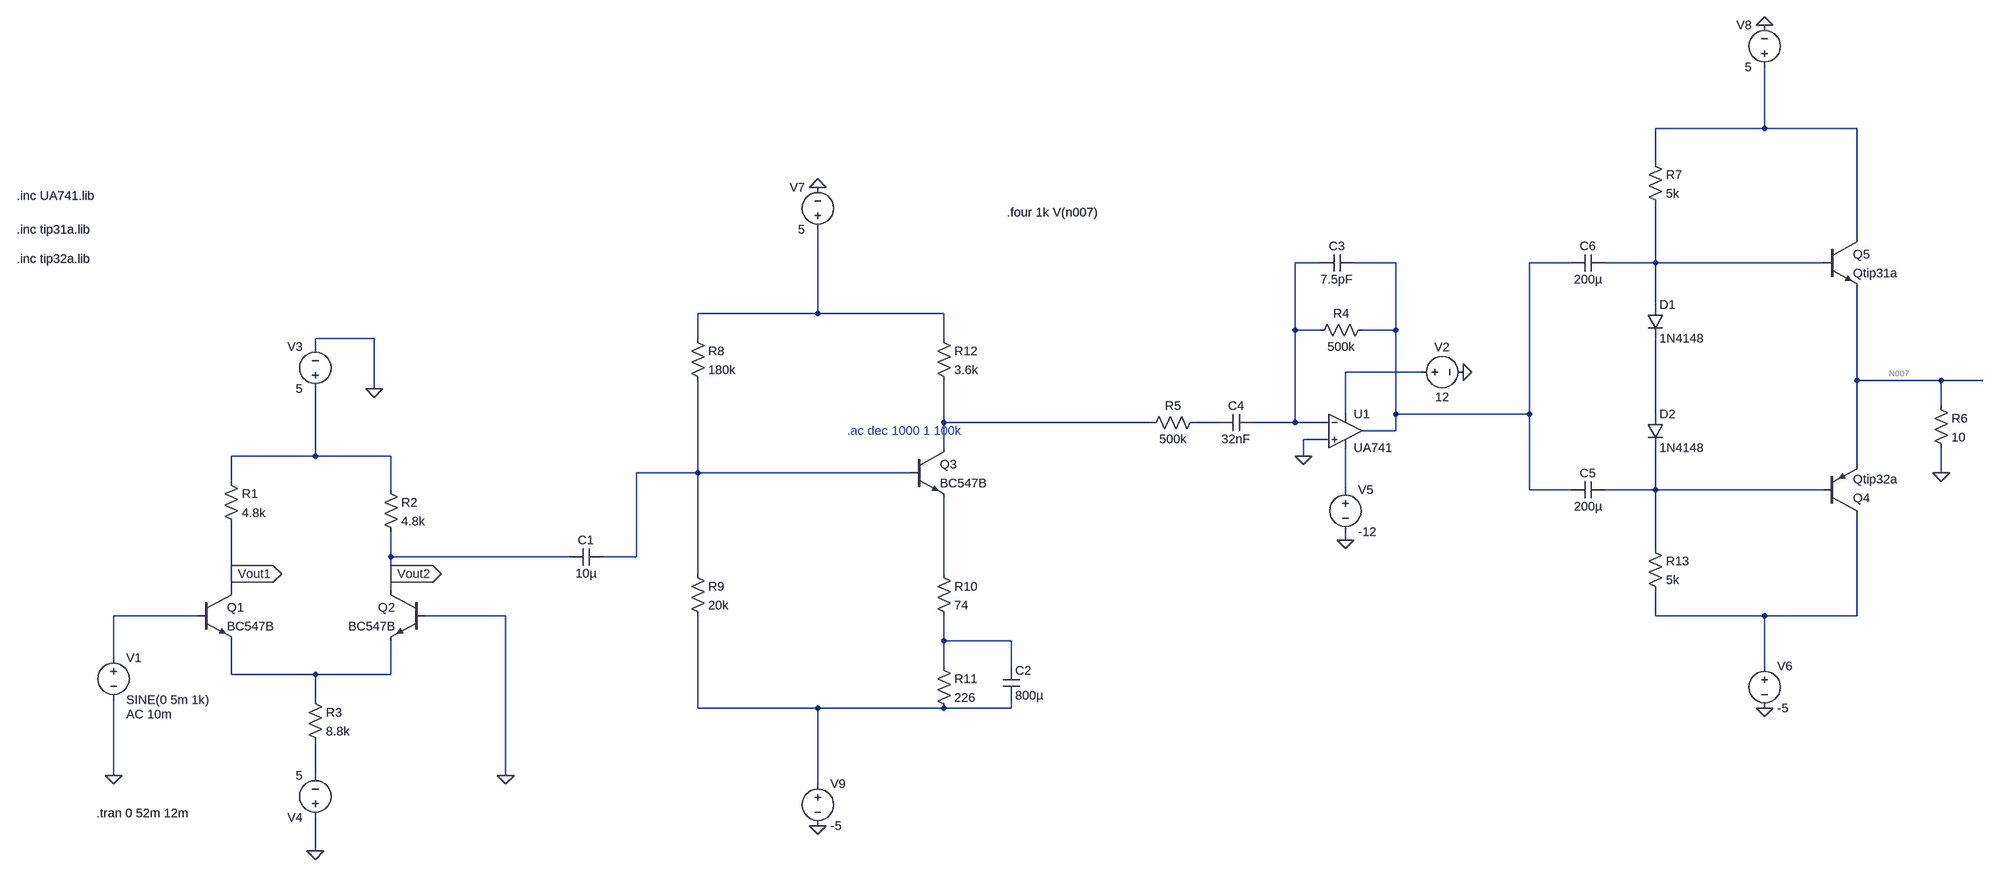
[diagram p0: schematic final_ckt.asc]
final_ckt.asc, the LTspice schematic file:
Version 4.1
SHEET 1 4872 680
WIRE 3392 -880 3392 -1040
WIRE 3392 -880 3184 -880
WIRE 3568 -880 3392 -880
WIRE 3184 -816 3184 -880
WIRE 3568 -672 3568 -880
WIRE 2528 -624 2480 -624
WIRE 2672 -624 2592 -624
WIRE 3024 -624 2944 -624
WIRE 3184 -624 3184 -736
WIRE 3184 -624 3088 -624
WIRE 3504 -624 3184 -624
WIRE 3184 -544 3184 -624
WIRE 1552 -528 1552 -688
WIRE 1552 -528 1312 -528
WIRE 1792 -528 1552 -528
WIRE 2480 -496 2480 -624
WIRE 2528 -496 2480 -496
WIRE 2672 -496 2672 -624
WIRE 2672 -496 2608 -496
WIRE 256 -480 144 -480
WIRE 1312 -480 1312 -528
WIRE 1792 -480 1792 -528
WIRE 144 -464 144 -480
WIRE 2720 -416 2576 -416
WIRE 3568 -400 3568 -576
WIRE 3728 -400 3568 -400
WIRE 3808 -400 3728 -400
WIRE 256 -384 256 -480
WIRE 3728 -352 3728 -400
WIRE 2576 -336 2576 -416
WIRE 2672 -336 2672 -496
WIRE 2944 -336 2944 -624
WIRE 2944 -336 2672 -336
WIRE 3184 -336 3184 -480
WIRE 1792 -320 1792 -400
WIRE 2208 -320 1792 -320
WIRE 2336 -320 2288 -320
WIRE 2480 -320 2480 -496
WIRE 2480 -320 2400 -320
WIRE 2544 -320 2480 -320
WIRE 2672 -304 2672 -336
WIRE 2672 -304 2608 -304
WIRE 2544 -288 2496 -288
WIRE 1792 -272 1792 -320
WIRE 144 -256 144 -384
WIRE 144 -256 -16 -256
WIRE 288 -256 144 -256
WIRE 2496 -256 2496 -288
WIRE 3568 -240 3568 -400
WIRE 1312 -224 1312 -400
WIRE 1312 -224 992 -224
WIRE 1728 -224 1312 -224
WIRE 3728 -224 3728 -272
WIRE -16 -208 -16 -256
WIRE 288 -192 288 -256
WIRE 2576 -192 2576 -272
WIRE 2944 -192 2944 -336
WIRE 3024 -192 2944 -192
WIRE 3184 -192 3184 -272
WIRE 3184 -192 3088 -192
WIRE 3504 -192 3184 -192
WIRE 2576 -96 2576 -112
WIRE 3184 -80 3184 -192
WIRE 288 -64 288 -112
WIRE 864 -64 288 -64
WIRE 992 -64 992 -224
WIRE 992 -64 928 -64
WIRE -16 -32 -16 -128
WIRE 288 -32 288 -64
WIRE 1312 -32 1312 -224
WIRE 1792 -32 1792 -176
WIRE -16 0 -16 -32
WIRE 288 0 288 -32
WIRE -80 48 -240 48
WIRE 528 48 352 48
WIRE 3184 48 3184 0
WIRE 3392 48 3184 48
WIRE 3568 48 3568 -144
WIRE 3568 48 3392 48
WIRE 1792 96 1792 48
WIRE 1920 96 1792 96
WIRE -240 128 -240 48
WIRE 1792 144 1792 96
WIRE 1920 144 1920 96
WIRE 3392 144 3392 48
WIRE -16 160 -16 96
WIRE 144 160 -16 160
WIRE 288 160 288 96
WIRE 288 160 144 160
WIRE 144 208 144 160
WIRE 1312 224 1312 48
WIRE 1552 224 1312 224
WIRE 1792 224 1552 224
WIRE 1920 224 1920 208
WIRE 1920 224 1792 224
WIRE -240 352 -240 208
WIRE 144 352 144 288
WIRE 528 352 528 48
WIRE 1552 368 1552 224
WIRE 144 496 144 432
FLAG -240 352 0
FLAG 528 352 0
FLAG 256 -384 0
FLAG -16 -32 Vout1
IOPIN -16 -32 Out
FLAG 288 -32 Vout2
IOPIN 288 -32 Out
FLAG 144 496 0
FLAG 1552 448 0
FLAG 1552 -768 0
FLAG 2496 -256 0
FLAG 2576 -96 0
FLAG 2800 -416 0
FLAG 3728 -224 0
FLAG 3392 -1120 0
FLAG 3392 224 0
SYMBOL npn -80 0 R0
SYMATTR InstName Q1
SYMATTR Value BC547B
SYMBOL res -32 -224 R0
SYMATTR InstName R1
SYMATTR Value 4.8k
SYMBOL res 272 -208 R0
SYMATTR InstName R2
SYMATTR Value 4.8k
SYMBOL res 128 192 R0
SYMATTR InstName R3
SYMATTR Value 8.8k
SYMBOL voltage -240 112 R0
WINDOW 123 24 124 Left 2
WINDOW 39 0 0 Left 0
SYMATTR Value2 AC 10m
SYMATTR InstName V1
SYMATTR Value SINE(0 5m 1k)
SYMBOL voltage 144 -368 R180
WINDOW 0 24 96 Left 2
WINDOW 3 24 16 Left 2
WINDOW 123 0 0 Left 0
WINDOW 39 0 0 Left 0
SYMATTR InstName V3
SYMATTR Value 5
SYMBOL voltage 144 448 R180
WINDOW 123 0 0 Left 0
WINDOW 39 0 0 Left 0
SYMATTR InstName V4
SYMATTR Value 5
SYMBOL npn 352 0 M0
SYMATTR InstName Q2
SYMATTR Value BC547B
SYMBOL res 1296 -496 R0
SYMATTR InstName R8
SYMATTR Value 180k
SYMBOL res 1296 -48 R0
SYMATTR InstName R9
SYMATTR Value 20k
SYMBOL res 1776 -48 R0
SYMATTR InstName R10
SYMATTR Value 74
SYMBOL res 1776 128 R0
SYMATTR InstName R11
SYMATTR Value 226
SYMBOL res 1776 -496 R0
SYMATTR InstName R12
SYMATTR Value 3.6k
SYMBOL npn 1728 -272 R0
SYMATTR InstName Q3
SYMATTR Value BC547B
SYMBOL cap 1904 144 R0
SYMATTR InstName C2
SYMATTR Value 800µ
SYMBOL voltage 1552 -672 R180
WINDOW 0 24 96 Left 2
WINDOW 3 24 16 Left 2
SYMATTR InstName V7
SYMATTR Value 5
SYMBOL voltage 1552 352 R0
SYMATTR InstName V9
SYMATTR Value -5
SYMBOL cap 928 -80 R90
WINDOW 0 0 32 VBottom 2
WINDOW 3 32 32 VTop 2
SYMATTR InstName C1
SYMATTR Value 10µ
SYMBOL OpAmps\\opamp2 2576 -368 R0
SYMATTR InstName U1
SYMATTR Value UA741
SYMBOL res 2624 -512 R90
WINDOW 0 0 56 VBottom 2
WINDOW 3 32 56 VTop 2
SYMATTR InstName R4
SYMATTR Value 500k
SYMBOL cap 2592 -640 R90
WINDOW 0 0 32 VBottom 2
WINDOW 3 32 32 VTop 2
SYMATTR InstName C3
SYMATTR Value 7.5pF
SYMBOL cap 2400 -336 R90
WINDOW 0 0 32 VBottom 2
WINDOW 3 32 32 VTop 2
SYMATTR InstName C4
SYMATTR Value 32nF
SYMBOL res 2304 -336 R90
WINDOW 0 0 56 VBottom 2
WINDOW 3 32 56 VTop 2
SYMATTR InstName R5
SYMATTR Value 500k
SYMBOL voltage 2704 -416 R270
WINDOW 0 32 56 VTop 2
WINDOW 3 -32 56 VBottom 2
WINDOW 123 0 0 Left 0
WINDOW 39 0 0 Left 0
SYMATTR InstName V2
SYMATTR Value 12
SYMBOL voltage 2576 -208 R0
WINDOW 123 0 0 Left 0
WINDOW 39 0 0 Left 0
SYMATTR InstName V5
SYMATTR Value -12
SYMBOL pnp 3504 -144 M180
SYMATTR InstName Q4
SYMATTR Value Qtip32a
SYMBOL npn 3504 -672 R0
SYMATTR InstName Q5
SYMATTR Value Qtip31a
SYMBOL res 3712 -368 R0
SYMATTR InstName R6
SYMATTR Value 10
SYMBOL res 3168 -832 R0
SYMATTR InstName R7
SYMATTR Value 5k
SYMBOL res 3168 -96 R0
SYMATTR InstName R13
SYMATTR Value 5k
SYMBOL diode 3168 -544 R0
SYMATTR InstName D1
SYMATTR Value 1N4148
SYMBOL diode 3168 -336 R0
SYMATTR InstName D2
SYMATTR Value 1N4148
SYMBOL cap 3088 -208 R90
WINDOW 0 0 32 VBottom 2
WINDOW 3 32 32 VTop 2
SYMATTR InstName C5
SYMATTR Value 200µ
SYMBOL cap 3088 -640 R90
WINDOW 0 0 32 VBottom 2
WINDOW 3 32 32 VTop 2
SYMATTR InstName C6
SYMATTR Value 200µ
SYMBOL voltage 3392 128 R0
SYMATTR InstName V6
SYMATTR Value -5
SYMBOL voltage 3392 -1024 R180
WINDOW 0 24 96 Left 2
WINDOW 3 24 16 Left 2
SYMATTR InstName V8
SYMATTR Value 5
TEXT -272 424 Left 2 !.tran 0 52m 12m
TEXT -424 -752 Left 2 !.inc UA741.lib
TEXT -424 -688 Left 2 !.inc tip31a.lib
TEXT -424 -632 Left 2 !.inc tip32a.lib
TEXT 1608 -304 Left 2 ;.ac dec 1000 1 100k
TEXT 1912 -720 Left 2 !.four 1k V(n007)

The netlist it stands for:
* final_ckt.asc
Q1 Vout1 N016 N019 0 BC547B
R1 N011 Vout1 4.8k
R2 N011 Vout2 4.8k
R3 N019 N021 8.8k
V1 N016 0 SINE(0 5m 1k) AC 10m
V3 N011 0 5
V4 0 N021 5
Q2 Vout2 0 N019 0 BC547B
R8 N005 N012 180k
R9 N012 N020 20k
R10 N015 N018 74
R11 N018 N020 226
R12 N005 N009 3.6k
Q3 N009 N012 N015 0 BC547B
C2 N018 N020 800µ
V7 N005 0 5
V9 N020 0 -5
C1 N012 Vout2 10µ
X§U1 0 N002 N006 N013 N003 UA741  ; pins In+ In- V+ V- OUT
R4 N003 N002 500k
C3 N003 N002 7.5pF
C4 N002 N010 32nF
R5 N010 N009 500k
V2 N006 0 12
V5 N013 0 -12
Q4 N017 N014 N007 0 Qtip32a
Q5 N001 N004 N007 0 Qtip31a
R6 N007 0 10
R7 N001 N004 5k
R13 N014 N017 5k
D1 N004 N008 1N4148
D2 N008 N014 1N4148
C5 N014 N003 200µ
C6 N004 N003 200µ
V6 N017 0 -5
V8 N001 0 5
.model D D
.lib standard.dio
.model NPN NPN
.model PNP PNP
.lib standard.bjt
.tran 0 52m 12m
.inc UA741.lib
.inc tip31a.lib
.inc tip32a.lib
* .ac dec 1000 1 100k
.four 1k V(n007)
.backanno
.end